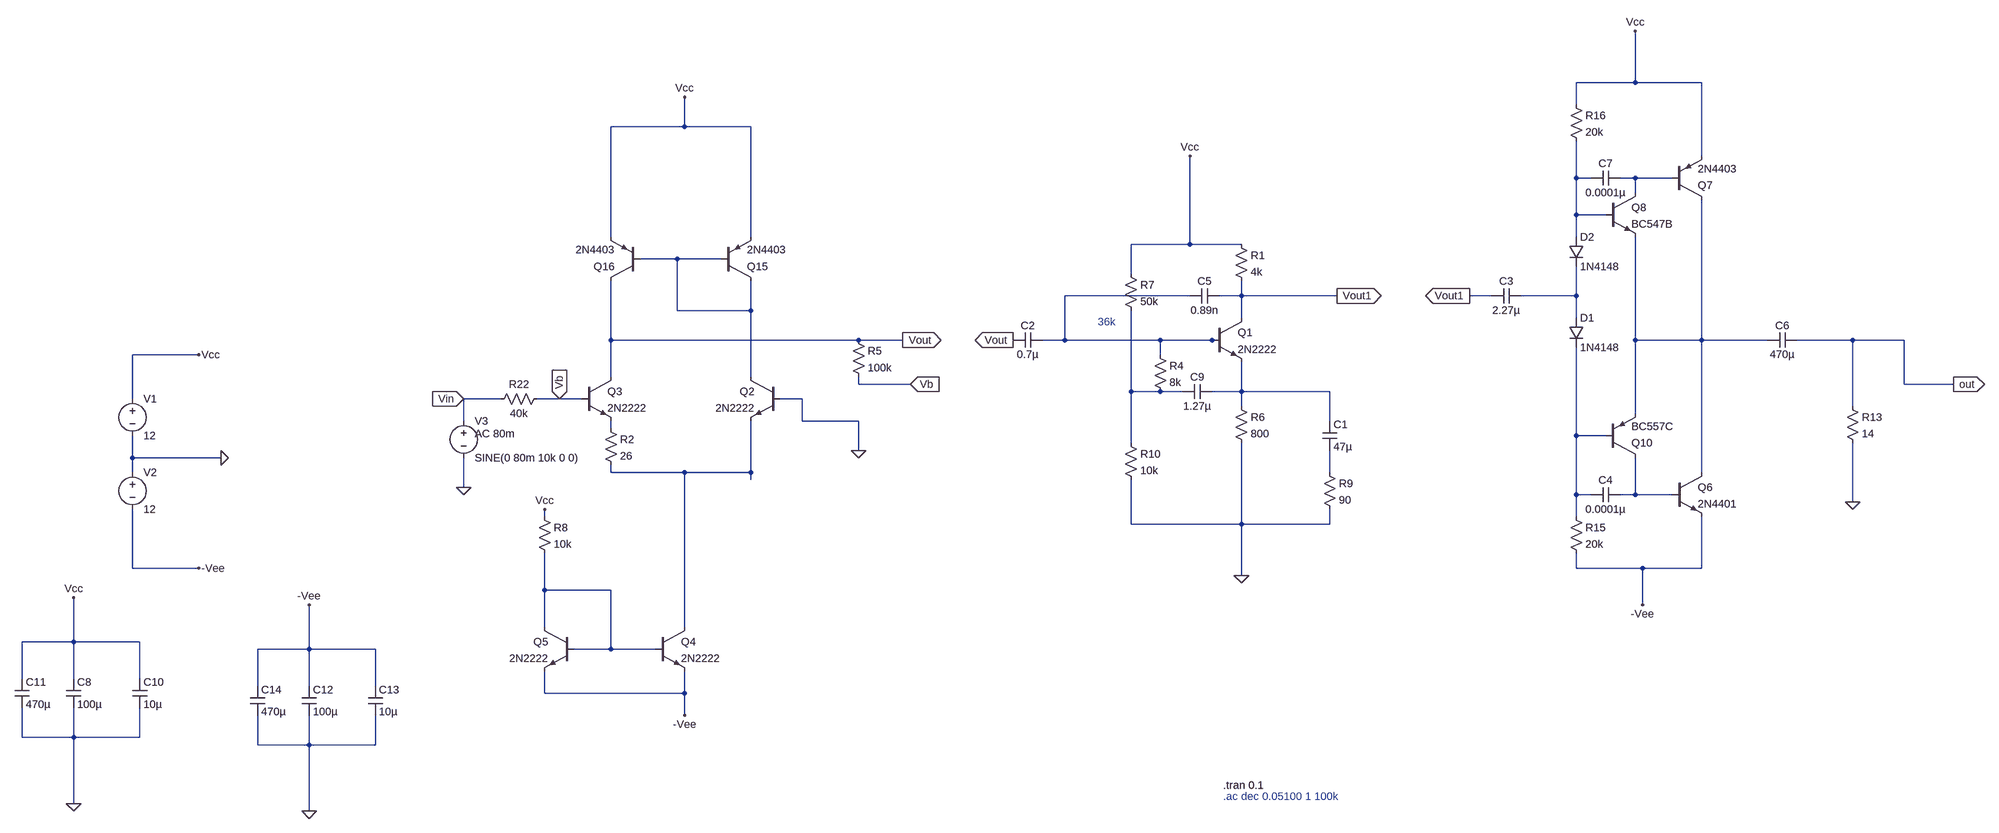
[diagram p0: schematic first_stage_v01.asc]
first_stage_v01.asc, the LTspice schematic file:
Version 4
SHEET 1 5460 1140
WIRE 2448 -1072 2448 -1184
WIRE 2448 -1072 2320 -1072
WIRE 2592 -1072 2448 -1072
WIRE 2320 -1024 2320 -1072
WIRE 160 -976 160 -1040
WIRE 160 -976 0 -976
WIRE 304 -976 160 -976
WIRE 2592 -912 2592 -1072
WIRE 2320 -864 2320 -944
WIRE 2352 -864 2320 -864
WIRE 2448 -864 2416 -864
WIRE 2528 -864 2448 -864
WIRE 2448 -832 2448 -864
WIRE 2320 -784 2320 -864
WIRE 2384 -784 2320 -784
WIRE 0 -736 0 -976
WIRE 304 -736 304 -976
WIRE 2320 -736 2320 -784
WIRE 1280 -720 1280 -912
WIRE 1280 -720 1152 -720
WIRE 1392 -720 1280 -720
WIRE 144 -688 64 -688
WIRE 240 -688 144 -688
WIRE 1152 -656 1152 -720
WIRE 1280 -608 1008 -608
WIRE 1392 -608 1392 -640
WIRE 1392 -608 1344 -608
WIRE 1600 -608 1392 -608
WIRE 1936 -608 1888 -608
WIRE 2320 -608 2320 -672
WIRE 2320 -608 2000 -608
WIRE 144 -576 144 -688
WIRE 304 -576 304 -640
WIRE 304 -576 144 -576
WIRE 1392 -560 1392 -608
WIRE 2320 -560 2320 -608
WIRE 0 -512 0 -640
WIRE 560 -512 0 -512
WIRE 656 -512 560 -512
WIRE 912 -512 896 -512
WIRE 1008 -512 1008 -608
WIRE 1008 -512 960 -512
WIRE 1216 -512 1008 -512
WIRE 1328 -512 1216 -512
WIRE 1344 -512 1328 -512
WIRE 2448 -512 2448 -736
WIRE 2592 -512 2592 -816
WIRE 2592 -512 2448 -512
WIRE 2736 -512 2592 -512
WIRE 2944 -512 2800 -512
WIRE 3056 -512 2944 -512
WIRE -896 -480 -1040 -480
WIRE 1216 -480 1216 -512
WIRE 0 -432 0 -512
WIRE 304 -432 304 -576
WIRE 560 -416 560 -432
WIRE 672 -416 560 -416
WIRE 3056 -416 3056 -512
WIRE 3200 -416 3056 -416
WIRE 1152 -400 1152 -576
WIRE 1216 -400 1152 -400
WIRE 1264 -400 1216 -400
WIRE 1392 -400 1392 -464
WIRE 1392 -400 1328 -400
WIRE 1584 -400 1392 -400
WIRE -1040 -384 -1040 -480
WIRE -240 -384 -320 -384
WIRE -112 -384 -160 -384
WIRE -64 -384 -112 -384
WIRE 416 -384 368 -384
WIRE 1392 -368 1392 -400
WIRE 2944 -368 2944 -512
WIRE 2448 -352 2448 -512
WIRE -320 -336 -320 -384
WIRE 416 -336 416 -384
WIRE 560 -336 416 -336
WIRE 1584 -336 1584 -400
WIRE 0 -320 0 -336
WIRE 2320 -304 2320 -496
WIRE 2384 -304 2320 -304
WIRE 1152 -288 1152 -400
WIRE 560 -272 560 -336
WIRE -1040 -256 -1040 -304
WIRE -848 -256 -1040 -256
WIRE -1040 -224 -1040 -256
WIRE 0 -224 0 -240
WIRE 160 -224 0 -224
WIRE 304 -224 304 -336
WIRE 304 -224 160 -224
WIRE 1584 -224 1584 -272
WIRE 2592 -224 2592 -512
WIRE 304 -208 304 -224
WIRE -320 -192 -320 -256
WIRE 2320 -176 2320 -304
WIRE 2352 -176 2320 -176
WIRE 2448 -176 2448 -256
WIRE 2448 -176 2416 -176
WIRE 2528 -176 2448 -176
WIRE 2944 -160 2944 -288
WIRE -144 -128 -144 -144
WIRE 2320 -128 2320 -176
WIRE 1152 -112 1152 -208
WIRE 1392 -112 1392 -288
WIRE 1392 -112 1152 -112
WIRE 1584 -112 1584 -144
WIRE 1584 -112 1392 -112
WIRE -1040 -16 -1040 -144
WIRE -896 -16 -1040 -16
WIRE 2320 -16 2320 -48
WIRE 2464 -16 2320 -16
WIRE 2592 -16 2592 -128
WIRE 2592 -16 2464 -16
WIRE 1392 0 1392 -112
WIRE -144 32 -144 -48
WIRE 0 32 -144 32
WIRE 2464 64 2464 -16
WIRE -144 112 -144 32
WIRE 160 112 160 -224
WIRE -1168 144 -1168 48
WIRE -1168 144 -1280 144
WIRE -1024 144 -1168 144
WIRE -656 160 -656 64
WIRE -656 160 -768 160
WIRE -512 160 -656 160
WIRE 0 160 0 32
WIRE 0 160 -80 160
WIRE 96 160 0 160
WIRE -1280 224 -1280 144
WIRE -1168 224 -1168 144
WIRE -1024 224 -1024 144
WIRE -768 240 -768 160
WIRE -656 240 -656 160
WIRE -512 240 -512 160
WIRE -144 256 -144 208
WIRE 160 256 160 208
WIRE 160 256 -144 256
WIRE 160 304 160 256
WIRE -1280 352 -1280 288
WIRE -1168 352 -1168 288
WIRE -1168 352 -1280 352
WIRE -1024 352 -1024 288
WIRE -1024 352 -1168 352
WIRE -768 368 -768 304
WIRE -656 368 -656 304
WIRE -656 368 -768 368
WIRE -512 368 -512 304
WIRE -512 368 -656 368
WIRE -1168 496 -1168 352
WIRE -656 512 -656 368
FLAG -320 -192 0
FLAG -848 -256 0
FLAG 656 -512 Vout
IOPIN 656 -512 Out
FLAG -144 -144 Vcc
FLAG 160 304 -Vee
FLAG -320 -384 Vin
IOPIN -320 -384 In
FLAG 1392 0 0
FLAG 1280 -912 Vcc
FLAG 1600 -608 Vout1
IOPIN 1600 -608 Out
FLAG 2944 -160 0
FLAG 3200 -416 out
IOPIN 3200 -416 Out
FLAG 560 -272 0
FLAG 672 -416 Vb
IOPIN 672 -416 In
FLAG 896 -512 Vout
IOPIN 896 -512 Out
FLAG 1888 -608 Vout1
IOPIN 1888 -608 Out
FLAG -112 -384 Vb
IOPIN -112 -384 In
FLAG -896 -480 Vcc
FLAG -896 -16 -Vee
FLAG 160 -1040 Vcc
FLAG 2448 -1184 Vcc
FLAG 2464 64 -Vee
FLAG -656 64 -Vee
FLAG -1168 496 0
FLAG -656 512 0
FLAG -1168 48 Vcc
SYMBOL npn2 368 -432 M0
SYMATTR InstName Q2
SYMATTR Value 2N2222
SYMBOL npn2 -64 -432 R0
SYMATTR InstName Q3
SYMATTR Value 2N2222
SYMBOL npn2 96 112 R0
SYMATTR InstName Q4
SYMATTR Value 2N2222
SYMBOL npn2 -80 112 M0
SYMATTR InstName Q5
SYMATTR Value 2N2222
SYMBOL voltage -1040 -400 R0
WINDOW 123 0 0 Left 0
WINDOW 39 0 0 Left 0
SYMATTR InstName V1
SYMATTR Value 12
SYMBOL voltage -1040 -240 R0
WINDOW 123 0 0 Left 0
WINDOW 39 0 0 Left 0
SYMATTR InstName V2
SYMATTR Value 12
SYMBOL voltage -320 -352 R0
WINDOW 123 24 44 Left 2
WINDOW 39 0 0 Left 0
SYMATTR Value2 AC 80m
SYMATTR InstName V3
SYMATTR Value SINE(0 80m 10k 0 0)
SYMBOL res -160 -144 R0
SYMATTR InstName R8
SYMATTR Value 10k
SYMBOL npn2 1328 -560 R0
SYMATTR InstName Q1
SYMATTR Value 2N2222
SYMBOL res 1376 -736 R0
SYMATTR InstName R1
SYMATTR Value 4k
SYMBOL res 1376 -384 R0
SYMATTR InstName R6
SYMATTR Value 800
SYMBOL res 1136 -672 R0
SYMATTR InstName R7
SYMATTR Value 50k
SYMBOL res 1136 -304 R0
SYMATTR InstName R10
SYMATTR Value 10k
SYMBOL cap 1568 -336 R0
SYMATTR InstName C1
SYMATTR Value 47µ
SYMATTR SpiceLine V=6.3 Irms=0 Rser=0 Lser=0
SYMBOL res 1568 -240 R0
SYMATTR InstName R9
SYMATTR Value 90
SYMATTR SpiceLine tol=1 pwr=0.1
SYMBOL cap 960 -528 R90
WINDOW 0 0 32 VBottom 2
WINDOW 3 32 32 VTop 2
SYMATTR InstName C2
SYMATTR Value 0.7µ
SYMATTR SpiceLine V=6.3 Irms=2.8 Rser=0.0497656 Lser=0
SYMBOL npn 2528 -224 R0
SYMATTR InstName Q6
SYMATTR Value 2N4401
SYMBOL pnp 2528 -816 M180
SYMATTR InstName Q7
SYMATTR Value 2N4403
SYMBOL diode 2304 -560 R0
SYMATTR InstName D1
SYMATTR Value 1N4148
SYMBOL cap 2000 -624 R90
WINDOW 0 0 32 VBottom 2
WINDOW 3 32 32 VTop 2
SYMATTR InstName C3
SYMATTR Value 2.27µ
SYMBOL res 2928 -384 R0
SYMATTR InstName R13
SYMATTR Value 14
SYMBOL cap 2800 -528 R90
WINDOW 0 0 32 VBottom 2
WINDOW 3 32 32 VTop 2
SYMATTR InstName C6
SYMATTR Value 470µ
SYMATTR SpiceLine V=6.3 Irms=2.84 Rser=0.031 Lser=0
SYMBOL npn 2384 -832 R0
SYMATTR InstName Q8
SYMATTR Value BC547B
SYMBOL res 2304 -144 R0
SYMATTR InstName R15
SYMATTR Value 20k
SYMBOL pnp 2384 -256 M180
SYMATTR InstName Q10
SYMATTR Value BC557C
SYMBOL res 2304 -1040 R0
SYMATTR InstName R16
SYMATTR Value 20k
SYMBOL diode 2304 -736 R0
SYMATTR InstName D2
SYMATTR Value 1N4148
SYMBOL pnp 240 -640 M180
SYMATTR InstName Q15
SYMATTR Value 2N4403
SYMBOL pnp 64 -640 R180
SYMATTR InstName Q16
SYMATTR Value 2N4403
SYMBOL res 1200 -496 R0
SYMATTR InstName R4
SYMATTR Value 8k
SYMBOL cap 1328 -416 R90
WINDOW 0 0 32 VBottom 2
WINDOW 3 32 32 VTop 2
SYMATTR InstName C9
SYMATTR Value 1.27µ
SYMBOL res 544 -528 R0
SYMATTR InstName R5
SYMATTR Value 100k
SYMBOL res -144 -400 R90
WINDOW 0 0 56 VBottom 2
WINDOW 3 32 56 VTop 2
SYMATTR InstName R22
SYMATTR Value 40k
SYMBOL cap 1344 -624 R90
WINDOW 0 0 32 VBottom 2
WINDOW 3 32 32 VTop 2
SYMATTR InstName C5
SYMATTR Value 0.89n
SYMBOL cap 2416 -192 R90
WINDOW 0 0 32 VBottom 2
WINDOW 3 32 32 VTop 2
SYMATTR InstName C4
SYMATTR Value 0.0001µ
SYMBOL cap 2416 -880 R90
WINDOW 0 0 32 VBottom 2
WINDOW 3 32 32 VTop 2
SYMATTR InstName C7
SYMATTR Value 0.0001µ
SYMBOL cap -1184 224 R0
SYMATTR InstName C8
SYMATTR Value 100µ
SYMBOL cap -1040 224 R0
SYMATTR InstName C10
SYMATTR Value 10µ
SYMBOL cap -1296 224 R0
SYMATTR InstName C11
SYMATTR Value 470µ
SYMBOL cap -672 240 R0
SYMATTR InstName C12
SYMATTR Value 100µ
SYMBOL cap -528 240 R0
SYMATTR InstName C13
SYMATTR Value 10µ
SYMBOL cap -784 240 R0
SYMATTR InstName C14
SYMATTR Value 470µ
SYMBOL res -16 -336 R0
SYMATTR InstName R2
SYMATTR Value 26
TEXT 1352 456 Left 2 !.tran 0.1
TEXT 1352 480 Left 2 ;.ac dec 0.05100 1 100k
TEXT 1080 -552 Left 2 ;36k

The netlist it stands for:
* first_stage_v01.asc
Q2 N003 0 N011 0 2N2222
Q3 Vout Vb N009 0 2N2222
Q4 N011 N014 -Vee 0 2N2222
Q5 N014 N014 -Vee 0 2N2222
V1 Vcc 0 12
V2 0 -Vee 12
V3 Vin 0 SINE(0 80m 10k 0 0) AC 80m
R8 Vcc N014 10k
Q1 Vout1 N004 N008 0 2N2222
R1 Vcc Vout1 4k
R6 N008 0 800
R7 Vcc N007 50k
R10 N007 0 10k
C1 N008 N012 47µ V=6.3 Irms=0 Rser=0 Lser=0
R9 N012 0 90 tol=1 pwr=0.1
C2 N004 Vout 0.7µ V=6.3 Irms=2.8 Rser=0.0497656 Lser=0
Q6 N006 N013 -Vee 0 2N4401
Q7 N006 N002 Vcc 0 2N4403
D1 N005 N010 1N4148
C3 N005 Vout1 2.27µ
R13 out 0 14
C6 out N006 470µ V=6.3 Irms=2.84 Rser=0.031 Lser=0
Q8 N002 N001 N006 0 BC547B
R15 N010 -Vee 20k
Q10 N013 N010 N006 0 BC557C
R16 Vcc N001 20k
D2 N001 N005 1N4148
Q15 N003 N003 Vcc 0 2N4403
Q16 Vout N003 Vcc 0 2N4403
R4 N004 N007 8k
C9 N008 N007 1.27µ
R5 Vout Vb 100k
R22 Vb Vin 40k
C5 Vout1 N004 0.89n
C4 N013 N010 0.0001µ
C7 N002 N001 0.0001µ
C8 Vcc 0 100µ
C10 Vcc 0 10µ
C11 Vcc 0 470µ
C12 -Vee 0 100µ
C13 -Vee 0 10µ
C14 -Vee 0 470µ
R2 N009 N011 26
.model D D
.lib standard.dio
.model NPN NPN
.model PNP PNP
.lib standard.bjt
.tran 0.1
* .ac dec 0.05100 1 100k
* 36k
.backanno
.end